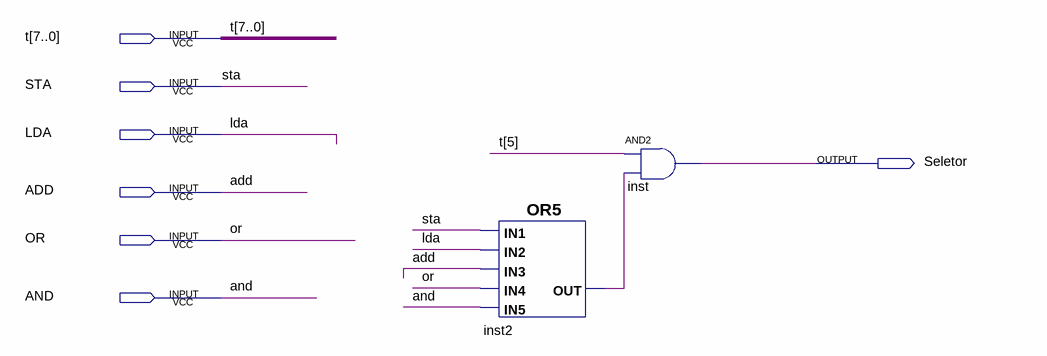
[diagram p0: schematic sheet]
// Quartus schematic SEL.bdf as structural Verilog: 2 symbols, 7 pins
module SEL (
  input  [7:0] t,
  input  STA,
  input  LDA,
  input  ADD,
  input  OR,
  input  AND,
  output Seletor
);

  wire inst2_out;

  or inst2 (inst2_out, STA, LDA, ADD, OR, AND);
  and inst (Seletor, t[5], inst2_out);
endmodule
